# EAGLE design Main (EAGLE 9.6.2)
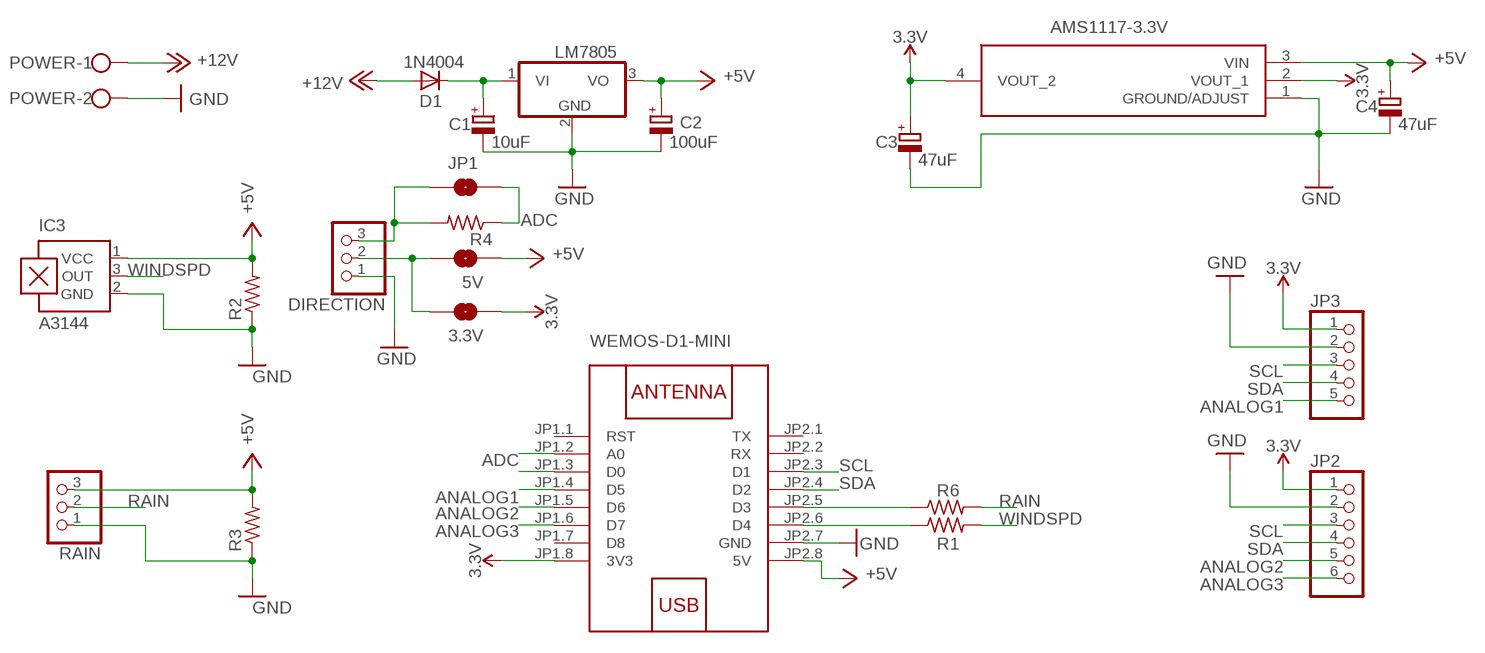
[diagram p0: schematic, sheet 1]

## Parts
3.3V  JUMPER-SMT_2_NO_NO-SILK  [SMT-JUMPER_2_NO_NO-SILK]
5V  JUMPER-SMT_2_NO_NO-SILK  [SMT-JUMPER_2_NO_NO-SILK]
C1  10uF  CPOL-EUE2.5-5  [E2,5-5]
C2  100uF  CPOL-EUE2.5-5  [E2,5-5]
C3  47uF  CPOL-EUE2.5-5  [E2,5-5]
C4  47uF  CPOL-EUE2.5-5  [E2,5-5]
D1  1N4004  [DO41-10]
DIRECTION  PINHD-1X3/90  [1X03/90]
IC1  LM7805  7805T  [TO220H]
IC2  AMS1117-3.3V  [SOT229P700X180-4N]
IC3  A3144  A1301UA  [SIP3-UA]
JP1  JUMPER-SMT_2_NO_NO-SILK  [SMT-JUMPER_2_NO_NO-SILK]
JP2  PINHD-1X6/90  [1X06/90]
JP3  PINHD-1X5/90  [1X05/90]
POWER  W237-102  [W237-102]
R1  R-US_0207/10  [0207/10]
R2  R-US_0207/10  [0207/10]
R3  R-US_0207/10  [0207/10]
R4  R-US_0207/10  [0207/10]
R6  R-US_0207/10  [0207/10]
RAIN  PINHD-1X3/90  [1X03/90]
U$1  WEMOS-D1-MINI  [WEMOS-D1-MINI]

## Nets
3.3V: 3.3V.1 C3.+ IC2.2(VOUT_1) IC2.4(VOUT_2) JP2.1 JP3.1 U$1.JP1.8(3V3)
+5V: 5V.1 C2.+ C4.+ IC1.3(VO) IC2.3(VIN) IC3.1(VCC) R2.2 R3.2 RAIN.3 U$1.JP2.8(5V)
+12V: D1.A POWER.1
ADC: JP1.2 R4.1 U$1.JP1.2(A0)
ANALOG1: JP3.5 U$1.JP1.4(D5)
ANALOG2: JP2.5 U$1.JP1.5(D6)
ANALOG3: JP2.6 U$1.JP1.6(D7)
GND: C1.- C2.- C3.- C4.- DIRECTION.1 IC1.2(GND) IC2.1(GROUND/ADJUST) IC3.2(GND) JP2.2 JP3.2 POWER.2 R2.1 R3.1 RAIN.1 U$1.JP2.7(GND)
N$1: C1.+ D1.C IC1.1(VI)
N$2: R1.1 U$1.JP2.6(D4)
N$3: R6.1 U$1.JP2.5(D3)
N$4: DIRECTION.3 JP1.1 R4.2
N$5: 3.3V.2 5V.2 DIRECTION.2
N$6: U$1.JP1.3(D0)
RAIN: R6.2 RAIN.2
SCL: JP2.3 JP3.3 U$1.JP2.3(D1)
SDA: JP2.4 JP3.4 U$1.JP2.4(D2)
WINDSPD: IC3.3(OUT) R1.2
Unconnected: U$1.JP1.1(RST) U$1.JP1.7(D8) U$1.JP2.1(TX) U$1.JP2.2(RX)

## Library data of the parts
3.3V 5V JP1 = SparkFun-Jumpers:JUMPER-SMT_2_NO: Normally open jumper This jumper has two pads in close proximity to each other. Apply solder to close the connection. Round pads are easier to solder for beginners, but are a lot larger. SparkFun Product that uses the round pads: SparkFun EL Sequencer <https://www.sparkfun.com/products/12781>
C1-C4 = rcl:CPOL-EU: POLARIZED CAPACITOR, European symbol; SPICEPREFIX: C
D1 = adafruit:1N4004: DIODE General purpose 1N400x type rectifier (With bigger pads) http://www.ladyada.net/library/pcb/eaglelibrary.html
DIRECTION RAIN = pinhead:PINHD-1X3: PIN HEADER
IC1 = adafruit:78*: Positive VOLTAGE REGULATOR Added bigger pads to the TO-92 package
IC2 = ams1117-3.3v:AMS1117-3.3V: 1A LOW DROPOUT VOLTAGE REGULATOR, SOT-223 Source: Datasheet <http://www.advanced-monolithic.com/pdf/ds1117.pdf>; DESCRIPTION: 1A LOW DROPOUT VOLTAGE REGULATOR, SOT-223; HEIGHT: 1.8mm; MANUFACTURER_NAME: Advanced Monolithic Systems; MANUFACTURER_PART_NUMBER: ams1117-3.3v
IC3 = allegro:A13*?: Linear Hall Effect Sensor ICs Continuous-Time Ratiometric High-Temperature Operation Programmable Linear with Analog Output A1302 -Replacement- UGN3503 Source: http://www.allegromicro.com/en/Products/Part_Numbers/1301/1301.pdf http://www.allegromicro.com/en/Products/Part_Numbers/1321/1321.pdf http://www.allegromicro.com/en/Products/Part_Numbers/1381/1381.pdf; MF: ALLEGRO MICROSYSTEMS, INC.; MPN: A1301EUA-T; OC_FARNELL: 1198085; OC_NEWARK: 31K6635
JP2 = pinhead:PINHD-1X6: PIN HEADER
JP3 = pinhead:PINHD-1X5: PIN HEADER
POWER = con-wago-500:W237-102: WAGO SCREW CLAMP; MPN: 237-102; OC_FARNELL: unknown; OC_NEWARK: 70K9898
R1-R4 R6 = rcl:R-US_: RESISTOR, American symbol; SPICEPREFIX: R
U$1 = diy-modules:WEMOS-D1-MINI: WEMOS D1 mini: Mini Wi-Fi Board based on ESP-8266 device More details can be found here: https://www.wemos.cc/product/d1-mini.html Click here to find device on ebay.com <http://www.ebay.com/sch/wemos+d1+mini+nodemcu>

## Board
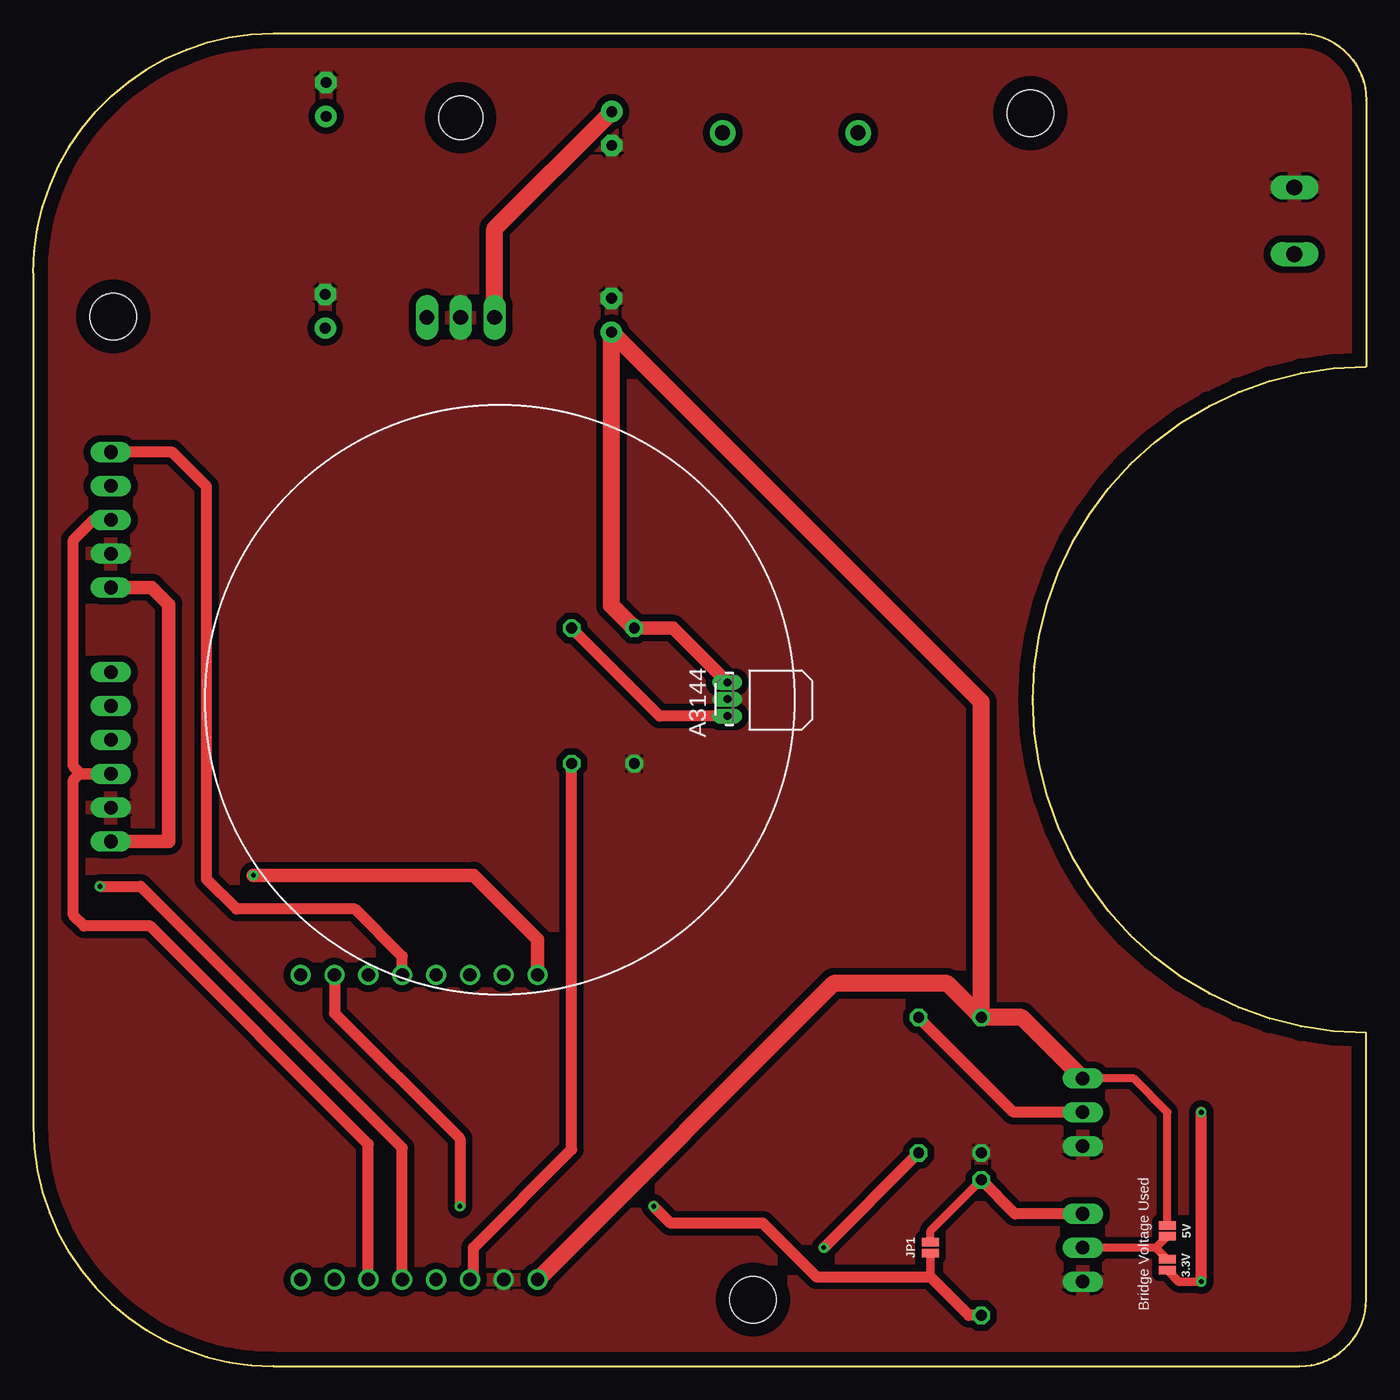
[diagram p1: board, top side]
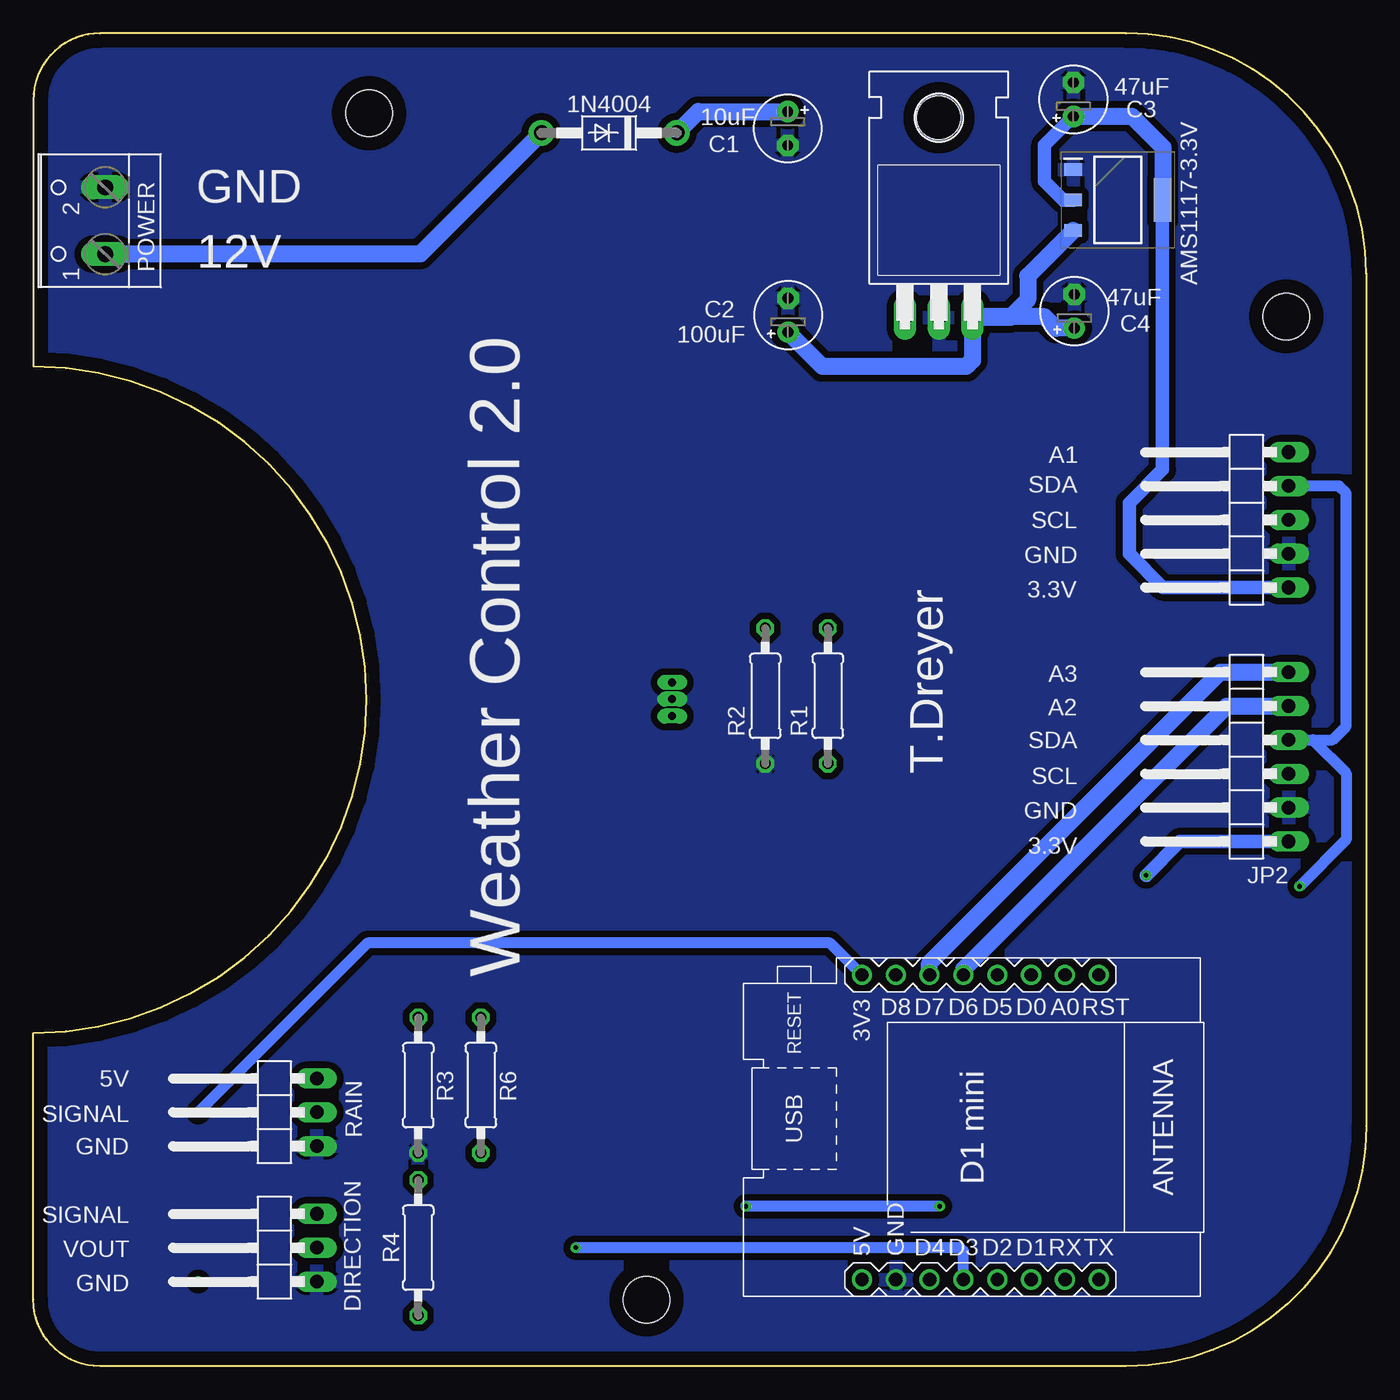
[diagram p2: board, bottom side, seen from below]

Size 100 x 100 mm. Coordinates in mm from the lower left corner, seen from the top.
Outline: 0,82 0,18 arc90 18,0 95,0 arc90 100,5 100,25 arc-180 100,75 100,95 arc90 95,100 18,100 arc90 0,82
Copper layers (1*16): Top 0.035mm / dielectric 1.5mm / Bottom 0.035mm
Design rules "default *": minimum track width 6mil, minimum drill 0.35mm, track to track 20mil, track to pad 6mil, pad to pad 6mil, via to via 6mil, smd to smd 6mil, copper to edge 40mil, drill to drill 6mil, minimum pad ring 10mil, minimum via ring 8mil, stop-mask expansion 4mil, vias tented up to drill 0mil, thermal gap 10mil
Holes 3.5 mm at 6,78.76 54,5 74.81,94

### Footprints (pad centres in the part's own frame; a part is rotated, then mirrored left to right if it is on the bottom)
SMT-JUMPER_2_NO_NO-SILK = smd 0.635 x 1.27: 1 -0.406,0; 2 0.406,0
E2,5-5 = drill 0.813 pad 1.6: + -1.27,0 | drill 0.813 pad 1.6 octagon: - 1.27,0
DO41-10 = drill 1.118 pad 1.93: A 5.08,0; C -5.08,0
1X03/90 = drill 1.016 long: 1 -2.54,-3.81; 2 0,-3.81; 3 2.54,-3.81
TO220H = drill 1.118 long: 1 -2.54,-10.16; 2 0,-10.16; 3 2.54,-10.16 | hole 3.302: 0,4.826
SOT229P700X180-4N = smd 1.3 x 0.95: 1 -3.35,2.29; 2 -3.35,0; 3 -3.35,-2.29 | smd 1.3 x 3.25: 4 3.35,0
SIP3-UA = drill 0.6 pad 0.7 long: 1 -1.27,0; 2 0,0; 3 1.27,0
1X06/90 = drill 1.016 long: 1 -6.35,-3.81; 2 -3.81,-3.81; 3 -1.27,-3.81; 4 1.27,-3.81; 5 3.81,-3.81; 6 6.35,-3.81
1X05/90 = drill 1.016 long: 1 -5.08,-3.81; 2 -2.54,-3.81; 3 0,-3.81; 4 2.54,-3.81; 5 5.08,-3.81
W237-102 = drill 1.194 long: 1 -2.5,-1.27; 2 2.5,-1.27
0207/10 = drill 0.813 octagon: 1 -5.08,0; 2 5.08,0
WEMOS-D1-MINI = drill 1: JP1.1 -11.43,9.525; JP1.2 -11.43,6.985; JP1.3 -11.43,4.445; JP1.4 -11.43,1.905; JP1.5 -11.43,-0.635; JP1.6 -11.43,-3.175; JP1.7 -11.43,-5.715; JP1.8 -11.43,-8.255; JP2.1 11.43,9.525; JP2.2 11.43,6.985; JP2.3 11.43,4.445; JP2.4 11.43,1.905; JP2.5 11.43,-0.635; JP2.6 11.43,-3.175; JP2.7 11.43,-5.715; JP2.8 11.43,-8.255

### Placement (x,y rotation side)
3.3V  85.09,7.62 90 top
5V  85.09,10.16 270 top
C1  43.4,92.86 270 bottom
C2  43.37,78.85 90 bottom
C3  21.96,95.04 90 bottom
C4  21.9,79.15 90 bottom
D1  56.8,92.53 180 bottom
DIRECTION  82.55,8.89 90 bottom
IC1  32.07,88.85 0 bottom
IC2  18.63,87.5 0 bottom
IC3  52.07,50.04 270 top
JP1  67.31,8.89 270 top
JP2  9.62,45.72 90 bottom
JP3  9.62,63.5 90 bottom
POWER  95.89,85.94 90 bottom
R1  40.39,50.29 90 bottom
R2  45.09,50.29 90 bottom
R3  71.12,21.08 90 bottom
R4  71.12,8.89 90 bottom
R6  66.42,21.08 90 bottom
RAIN  82.55,19.05 90 bottom
U$1  29.58,17.93 270 bottom

### Tracks (layer width: path | path; a pad name or v marks a point on that pad's centre or on a via)
3.3V  (via drill 0.35)
  Top 0.635: 3.3V.1 85.95,6.35 v87.63,6.35
  Top 0.813: v87.63,6.35 v87.63,19.05
  Top 1.016: v16.51,36.83 33.02,36.83 37.84,32.02 U$1.JP1.8 | JP2.1 10.16,39.37 10.16,57.15 8.89,58.42 JP3.1
  Bottom 0.813: U$1.JP1.8 40.23,31.75 74.93,31.75 v87.63,19.05
  Bottom 1.016: JP3.1 15.24,58.42 17.78,60.96 17.78,64.77 15.29,67.27 IC2.4 | JP2.1 13.97,39.37 v16.51,36.83 | IC2.2 22.73,87.5 24.13,88.9 24.13,91.6 C3.+
  Bottom 1.27: C3.+ 17.57,93.77 15.24,91.44 15.24,87.54 IC2.4
+5V
  Top 0.61: 5V.1 85.09,19.05 82.55,21.59 RAIN.3
  Top 1.016: IC3.1 48.01,55.37 R2.2
  Top 1.27: U$1.JP2.8 60.04,28.7 68.58,28.7 R3.2 | R3.2 71.12,49.83 C2.+ 43.37,57.09 R2.2 | RAIN.3 74.17,26.16 R3.2
  Bottom 1.27: IC1.3 29.53,75.47 30,75 40.79,75 C2.+ | IC1.3 29.38,78.54 29.18,78.74 24.13,78.74 23.27,77.88 C4.+ | IC2.3 25.4,81.79 25.4,80.01 26.72,78.69 IC1.3
+12V
  Bottom 1.27: 92.92,83.44 POWER.1 70.97,83.44 D1.A
ADC  (via drill 0.35)
  Top 0.635: 67.31,6.69 JP1.2
  Top 0.813: U$1.JP1.2 22.59,26.48 32,17.08 v32,12 | v46.54,12 47.81,10.73 54.73,10.73 58.77,6.69 67.31,6.69 70.19,3.81 R4.1
  Bottom 0.813: v32,12 v46.54,12
ANALOG1
  Top 0.813: JP3.5 10.42,68.58 13,66 13,36.53 15.24,34.29 24.13,34.29 27.68,30.75 U$1.JP1.4
ANALOG2
  Bottom 1.27: U$1.JP1.5 30.21,29.79 10.47,49.53 JP2.5
ANALOG3
  Bottom 1.27: U$1.JP1.6 32.76,30.25 10.93,52.07 JP2.6
GND
  pour Top: -6.35,102.87 -6.35,-3.81 105.41,-3.81 105.41,102.87
  pour Bottom: -8.89,105.41 -8.89,-6.35 109.22,-6.35 109.22,105.41
N$1
  Top 1.27: IC1.1 34.61,85.34 C1.+
  Bottom 1.27: D1.C 50.12,94.13 C1.+
N$2
  Top 0.813: U$1.JP2.6 33.02,6.76 33.02,8.89 40.39,16.26 R1.1
N$3  (via drill 0.35)
  Top 0.813: v59.31,8.89 R6.1
  Bottom 0.813: U$1.JP2.5 30.21,8.62 30.48,8.89 v59.31,8.89
N$4
  Top 0.61: JP1.1 67.31,10.16 R4.2
  Top 0.813: DIRECTION.3 73.66,11.43 R4.2
N$5
  Top 0.61: 5V.2 84.23,8.89 | DIRECTION.2 83.82,8.89 84.23,8.89 | 3.3V.2 84.23,8.89
RAIN
  Top 0.813: RAIN.2 73.53,19.05 R6.2
SCL
  Top 0.813: U$1.JP2.3 25.14,16.66 8.78,33.02 3.81,33.02 3,33.83 3,44 3.45,44.45 JP2.3 3.55,44.45 3,45 3,62 4.5,63.5 JP3.3
SDA  (via drill 0.35)
  Top 0.813: U$1.JP2.4 27.68,16.38 8.05,36 v5,36
  Bottom 0.813: v5,36 1.5,39.5 1.5,44.5 3.99,46.99 JP2.4 2.51,46.99 1.5,48 1.5,65.5 2.04,66.04 JP3.4
WINDSPD
  Top 0.813: IC3.3 46.99,48.77 R1.2

### Text on the board
tPlace: Bridge Voltage Used
bPlace: GND | 12V | A1 | SDA | SCL | GND | 3.3V | A3 | A2 | SDA | SCL | T.Dreyer | GND | 3.3V | Weather Control 2.0 | 5V | SIGNAL | GND | SIGNAL | VOUT | GND